# Altium project lab8.PrjPcb
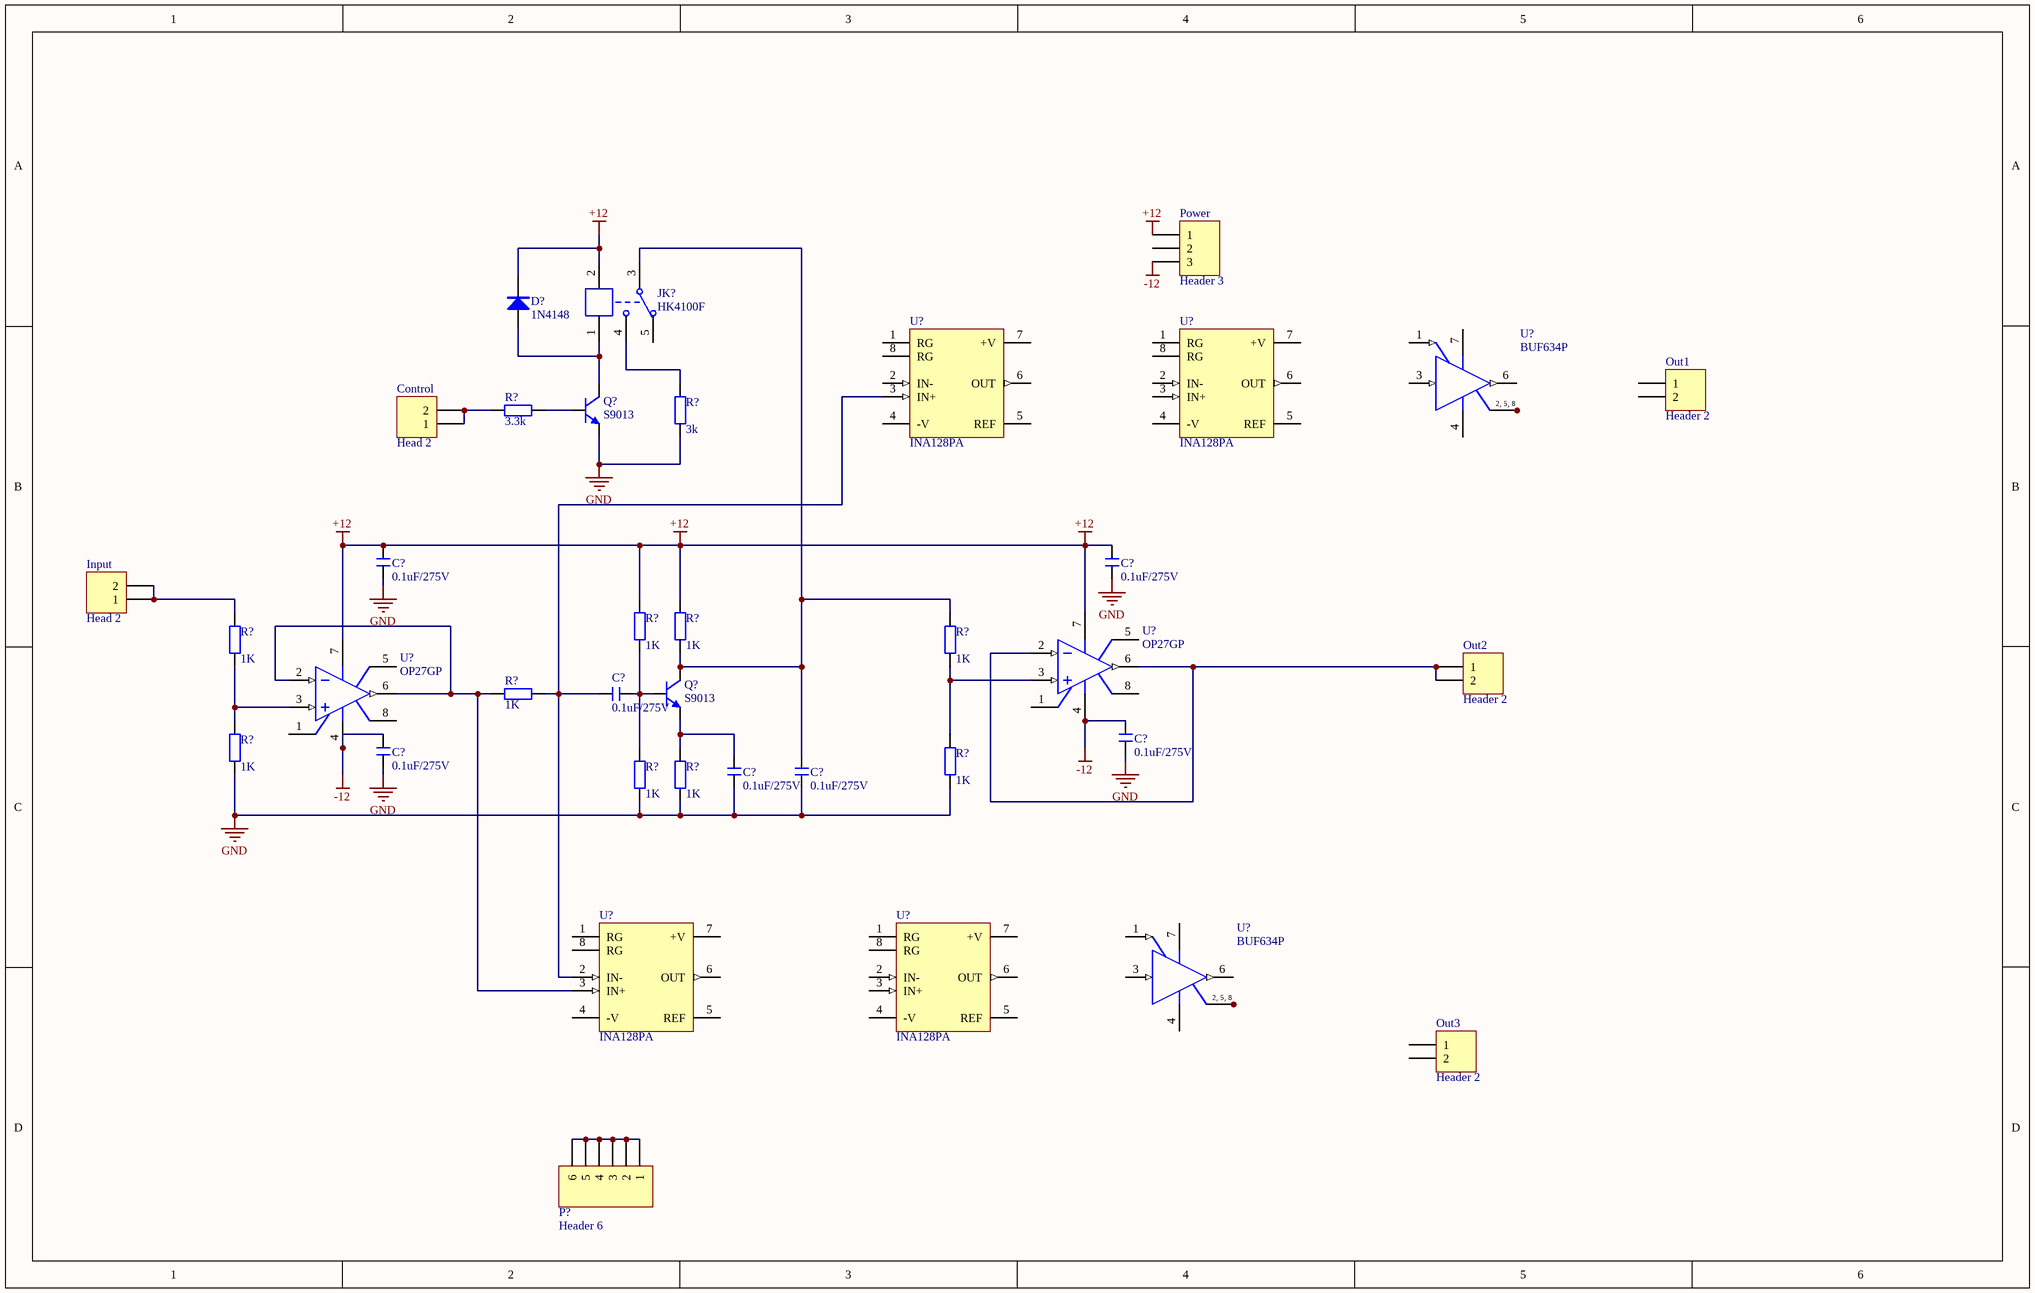
[diagram p0: Sheet1.SchDoc]
1 sheet, 37 parts. Net scope: global (net labels, ports and power ports of the same name join across sheets).
Board file: PCB1.PcbDoc

## Sheet Sheet1.SchDoc
size 381 x 241 mm; SheetNumber: 1; SheetTotal: 1

### Parts
(Parts that share a designator on the sheet are numbered #1, #2 ... from top to bottom, then left to right.)
C7  0.1uF/275V  [CBB-CL71]
C8  0.1uF/275V  [CBB-CL71]
C9  0.1uF/275V  [CBB-CL71]
C10  0.1uF/275V  [CBB-CL71]
C11  0.1uF/275V  [CBB-CL71]
C12  0.1uF/275V  [CBB-CL71]
C13  0.1uF/275V  [CBB-CL71]
Control  Head 2  [HDR1X2]
D1  1N4148  [MINI_MELF (LL34)]
Input  Head 2  [HDR1X2]
JK1  HK4100F  [DIP14]
Out1  Header 2  [HDR1X2]
Out2  Header 2  [HDR1X2]
Out3  Header 2  [HDR1X2]
P1  Header 6  [HDR1X6]
Power  Header 3  [HDR1X3]
Q1  S9013  [TO92]
Q2  S9013  [TO92]
R4  value 3.3k  [AXIAL-0.4]
R5  value 3k  [AXIAL-0.4]
R7  value 1K  [AXIAL-0.4]
R8  value 1K  [AXIAL-0.4]
R9  value 1K  [AXIAL-0.4]
R10  value 1K  [AXIAL-0.4]
R11  value 1K  [AXIAL-0.4]
R12  value 1K  [AXIAL-0.4]
R13  value 1K  [AXIAL-0.4]
R14  value 1K  [AXIAL-0.4]
R15  value 1K  [AXIAL-0.4]
U4  OP27GP  [N-8_A]
U5  OP27GP  [N-8_A]
U6  INA128PA  [006E]
U7  INA128PA  [006E]
U8  BUF634P  [006E]
U?#1  INA128PA  [006E]
U?#2  INA128PA  [006E]
U?#3  BUF634P  [006E]

### Nets
+12: C7.1 C8.1 D1.2(K) JK1.2 Power.1 R7.2 R8.2 U4.7(V+) U5.7(V+)
-12: C11.1 C13.1 Power.3 U4.4(V-) U5.4(V-)
GND: C7.2 C8.2 C10.1 C11.2 C12.1 C13.2 Q1.1(E) R5.1 R12.1 R13.1 R14.1 R15.1
NetC9_1: C9.1 R11.1 U6.2(IN-) U?#1.3(IN+)
NetC9_2: C9.2 Q2.2(B) R7.1 R14.2
NetC10_2: C10.2 JK1.3 Q2.3(C) R8.1 R10.2
NetC12_2: C12.2 Q2.1(E) R15.2
NetControl_1: Control.1 Control.2 R4.2
NetD1_1: D1.1(A) JK1.1 Q1.3(C)
NetInput_1: Input.1 Input.2 R9.2
NetJK1_4: JK1.4 R5.2
NetOut2_1: Out2.1 Out2.2 U4.2(IN-) U4.6(OUT)
NetP1_1: P1.1 P1.2 P1.3 P1.4 P1.5 P1.6
NetQ1_2: Q1.2(B) R4.1
NetR9_1: R9.1 R12.2 U5.3(IN+)
NetR10_1: R10.1 R13.2 U4.3(IN+)
NetR11_2: R11.2 U5.2(IN-) U5.6(OUT) U6.3(IN+)
NetU8_2: U8.2(NC) U8.5(NC) U8.8(NC)
NetU?#3_2: U?#3.2(NC) U?#3.5(NC) U?#3.8(NC)

Not connected (* = marked no-connect by the designer): JK1 5; Out1 1 2; Out3 1 2; Power 2; U4 1(CMPEN) 5(NC) 8(CMPEN); U5 1(CMPEN) 5(NC) 8(CMPEN); U6 1(RG) 4(-V) 5(REF) 6(OUT) 7(+V) 8(RG); U7 1(RG) 2(IN-) 3(IN+) 4(-V) 5(REF) 6(OUT) 7(+V) 8(RG); U8 1(BW) 3(IN) 4(V-) 6(OUT) 7(V+); U?#1 1(RG) 2(IN-) 4(-V) 5(REF) 6(OUT) 7(+V) 8(RG); U?#2 1(RG) 2(IN-) 3(IN+) 4(-V) 5(REF) 6(OUT) 7(+V) 8(RG); U?#3 1(BW) 3(IN) 4(V-) 6(OUT) 7(V+)

### Notes on the sheet
- (in symbol BUF634P) 2, 5, 8

### Library data of the parts
C7-C13 = C-CBB: CBB电容; 版权归属: 源创客; BOM名称: CBB电容; 学习资源: www.ooocke.com
Control Input Out1-Out3 = Header 2: Header, 2-Pin; LatestRevisionDate: 17-Jul-2002; LatestRevisionNote: Re-released for DXP Platform.; Publisher: Altium Limited
D1 = 1N4148: 高速开关二极管; 版权归属: 源创客; BOM名称: 高速开关二极管; 学习资源: www.ooocke.com
JK1 = HK4100F: 一组转换; BOM名称: 一组继电器; 版权归属: 源创客; 学习资源: www.ooocke.com
P1 = Header 6: Header, 6-Pin; LatestRevisionDate: 17-Jul-2002; LatestRevisionNote: Re-released for DXP Platform.; Publisher: Altium Limited
Power = Header 3: Header, 3-Pin; LatestRevisionDate: 17-Jul-2002; LatestRevisionNote: Re-released for DXP Platform.; Publisher: Altium Limited
Q1 Q2 = 9013-DIP: 低频放大-NPN型; 版权归属: 源创客; 属性: 50V 0.5A 0.625W; BOM名称: 低频放大-NPN型; 学习资源: www.ooocke.com
R4 R5 R7-R15 = Res2: Resistor; Published: 8-Jun-2000; LatestRevisionDate: 17-Jul-2002; LatestRevisionNote: Re-released for DXP Platform.; PackageReference: AXIAL-0.4; Publisher: Altium Limited; PackageDescription: Axial Device, Thru-Hole; 2 Leads; 0.4 in Pin Spacing
U4 U5 = OP27GP: Low-Noise, Precision Operational Amplifier; Note: Pin 5 is not connected.; Published: 8-Jun-2000; LatestRevisionDate: 06-Jun-2005; LatestRevisionNote: Stylized 3D Model Added.; DatasheetVersion: Oct-1996; PackageVersion: revE; PackageReference: 006E; Publisher: Altium Limited; PackageDescription: DIP; 8 Leads; Row Spacing 7.62 mm; Pitch 2.54 mm; ComponentLink1Description: Manufacturer Link; ComponentLink1URL: http://www.ti.com/; ComponentLink2Description: Datasheet; ComponentLink2URL: http://www-s.ti.com/sc/ds/INA128.pdf
U6 U7 U?#1 U?#2 = INA128PA: Precision, Low-Power Instrumentation Amplifiers; Published: 8-Jun-2000; LatestRevisionDate: 06-Jun-2005; LatestRevisionNote: Stylized 3D Model Added.; DatasheetVersion: Jun-1996; PackageVersion: revE; PackageReference: 006E; Publisher: Altium Limited; PackageDescription: DIP; 8 Leads; Row Spacing 7.62 mm; Pitch 2.54 mm; ComponentLink1Description: Manufacturer Link; ComponentLink1URL: http://www.ti.com/; ComponentLink2Description: Datasheet; ComponentLink2URL: http://www-s.ti.com/sc/ds/BUF634.pdf
U8 U?#3 = BUF634P: 250mA High-Speed Buffer; Note: Pins 2, 5 and 8 are No internal Connection (NC) pins.; Published: 8-Jun-2000; LatestRevisionDate: 04-Mar-2005; LatestRevisionNote: Stylized 3D Model Added.; DatasheetVersion: 1992; PackageReference: N-8_A; Publisher: Altium Limited; PackageDescription: DIP; 8 Leads; Row Spacing 7.62 mm; Pitch 2.54 mm; Code_JEDEC: MO-001-AN; ComponentLink1Description: Manufacturer Link; ComponentLink1URL: http://www.analog.com/en/prod/0,,759_786_OP27%2C00.html; ComponentLink2Description: Datasheet; ComponentLink2URL: http://www.analog.com/UploadedFiles/Data_Sheets/314538596OP27_c.pdf